# EAGLE design Illuminator v2 (EAGLE 9.6.2)
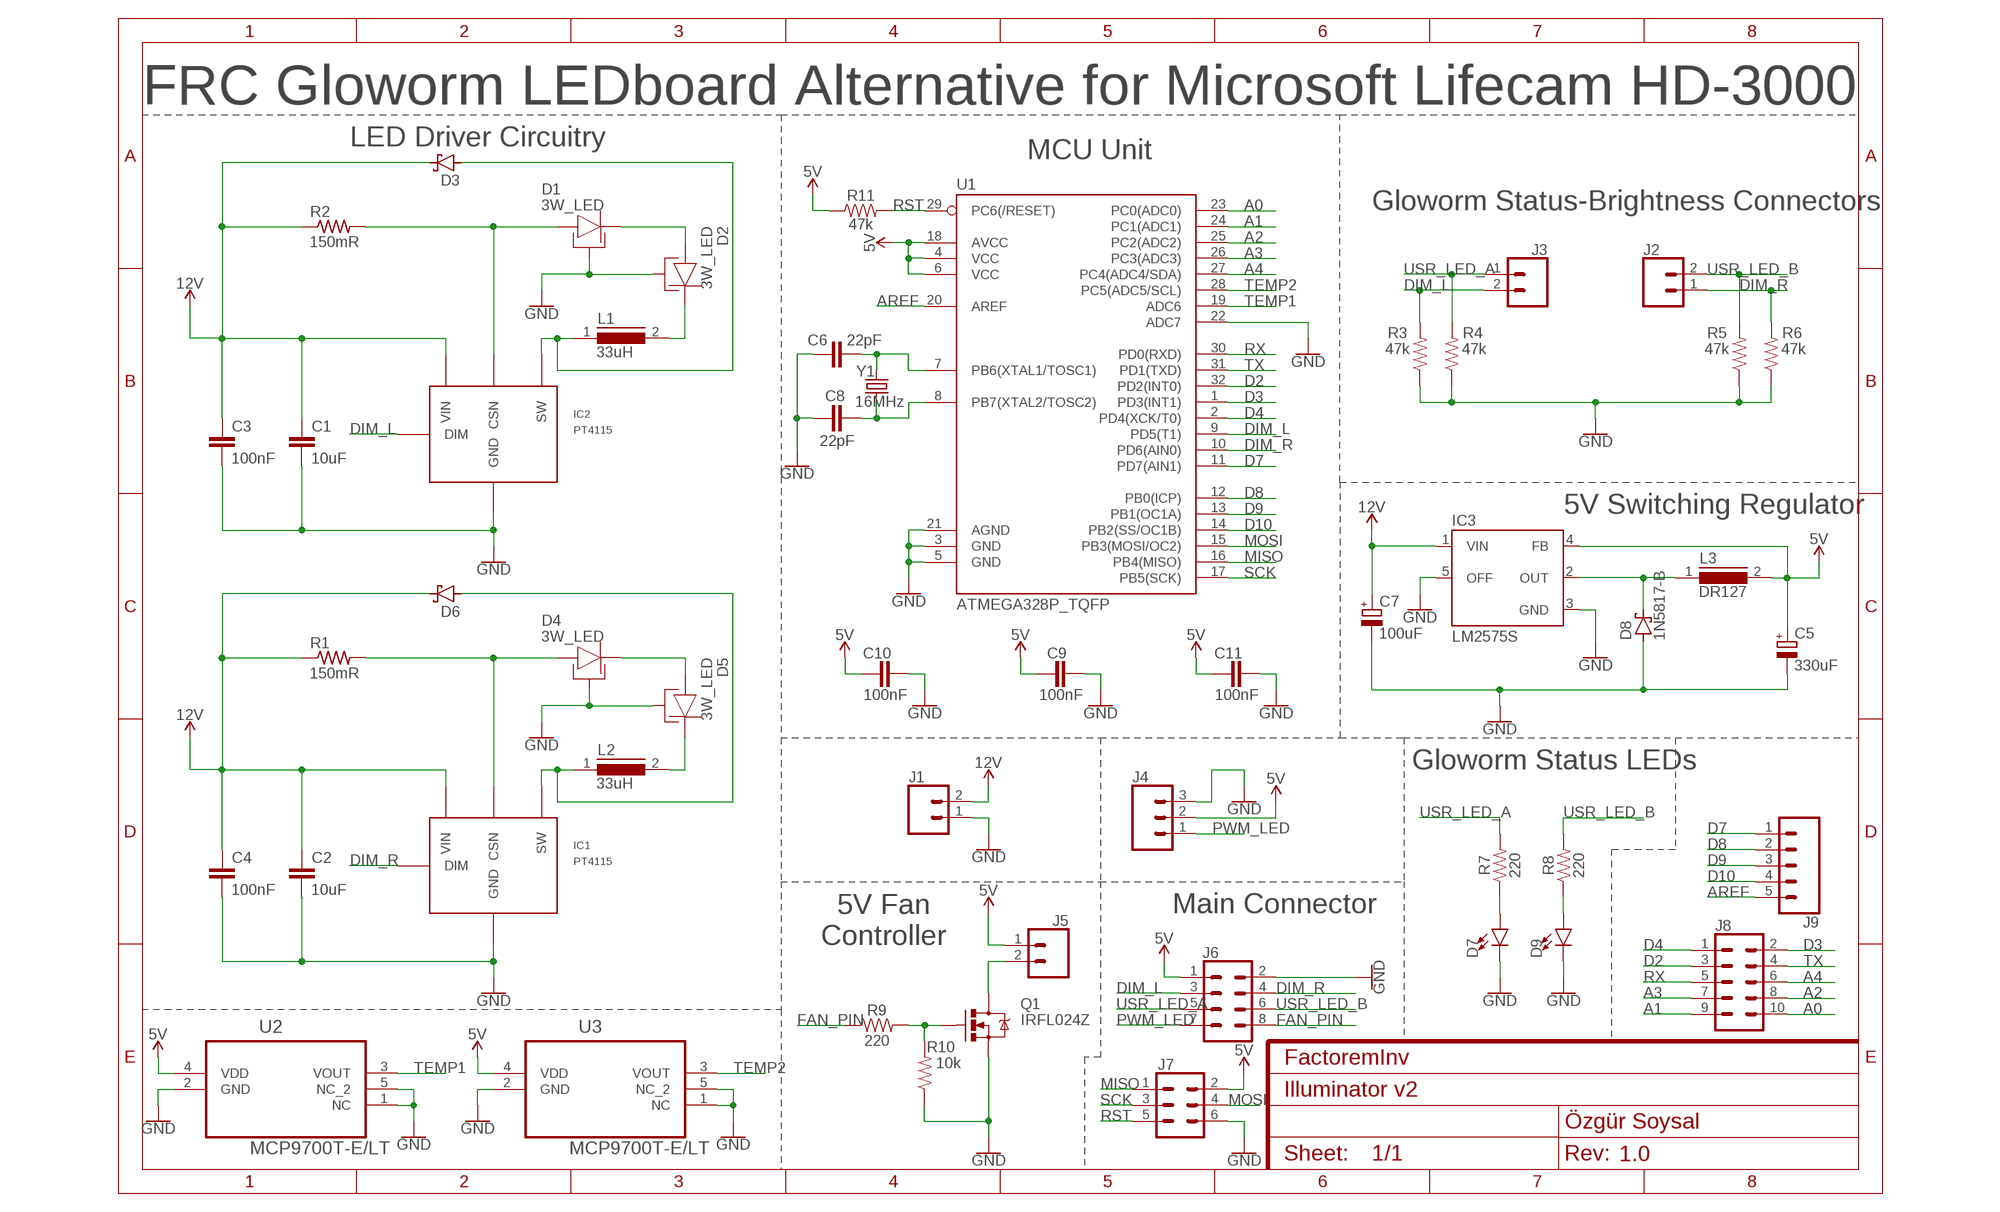
[diagram p0: schematic, sheet 1]
FRAME1 (FRAME-A4L): CNAME: FactoremInv; CREVISION: 1.0; DESIGNER: Özgür Soysal

## Parts
C1  10uF  10UF-1206-6.3V-20%  [1206]
C2  10uF  10UF-1206-6.3V-20%  [1206]
C3  100nF  1.0UF-0805-25V-(+80/-20%)  [0805]
C4  100nF  1.0UF-0805-25V-(+80/-20%)  [0805]
C5  330uF  C-POL_ECAP-10.5MM  [CAPAE1030X1050N]
C6  22pF  22PF-0603-50V-5%  [0603]
C7  100uF  C-POL_ECAP-8.5MM  [CAPAE830X1050N]
C8  22pF  22PF-0603-50V-5%  [0603]
C9  100nF  1.0UF-0805-25V-(+80/-20%)  [0805]
C10  100nF  1.0UF-0805-25V-(+80/-20%)  [0805]
C11  100nF  1.0UF-0805-25V-(+80/-20%)  [0805]
D1  3W_LED  [3W_LED]
D2  3W_LED  [3W_LED]
D3  SCHOTTKY-DIODESMD  [SMB]
D4  3W_LED  [3W_LED]
D5  3W_LED  [3W_LED]
D6  SCHOTTKY-DIODESMD  [SMB]
D7  LED1206  [LED-1206]
D8  1N5817-B  [DO41-7.6]
D9  LED1206  [LED-1206]
IC1  PT4115  [PT4115]
IC2  PT4115  [PT4115]
IC3  LM2575S  [TO263-5]
J1  CONN_02SPRING-2.54-RA  [SPRINGTERMINAL-2.54MM-2]
J2  CONN_02  [1X02]
J3  CONN_02  [1X02]
J4  CONN_03  [1X03]
J5  CONN_02  [1X02]
J6  CONN_04X2  [2X4]
J7  CONN_03X2NO_SILK  [2X3-NS]
J8  CONN_05X2NO_SILK  [2X5_NOSILK]
J9  CONN_05NO_SILK  [1X05_NO_SILK]
L1  33uH  DR125  [DR125]
L2  33uH  DR125  [DR125]
L3  DR127  [DR127]
Q1  IRFL024Z  MOSFET-NCHANNEL-SOT-223  [SOT-223]
R1  150mR  R-US_R2512  [R2512]
R2  150mR  R-US_R2512  [R2512]
R3  47k  RESISTOR0805  [0805]
R4  47k  RESISTOR0805  [0805]
R5  47k  RESISTOR0805  [0805]
R6  47k  RESISTOR0805  [0805]
R7  220  RESISTOR1206  [1206]
R8  220  RESISTOR1206  [1206]
R9  220  RESISTOR1206  [1206]
R10  10k  RESISTOR1206  [1206]
R11  47k  RESISTOR0805  [0805]
U1  ATMEGA328P_TQFP  [TQFP32-08]
U2  MCP9700T-E/LT  [SOT65P210X110-5N]
U3  MCP9700T-E/LT  [SOT65P210X110-5N]
Y1  16MHz  CRYSTAL-16MHZSMD-5X3.2  [CRYSTAL-SMD-5X3.2-4PAD]

## Nets
5V: C5.1(+) C9.1 C10.1 C11.1 IC3.4(FB) J4.2 J5.1 J6.1 J7.2 L3.2 R11.1 U1.4(VCC) U1.6(VCC) U1.18(AVCC) U2.4(VDD) U3.4(VDD)
12V: C1.1 C2.1 C3.1 C4.1 C7.1(+) D3.C D6.C IC1.5(VIN) IC2.5(VIN) IC3.1(VIN) J1.2 R1.1 R2.1
A0: J8.10 U1.23(PC0(ADC0))
A1: J8.9 U1.24(PC1(ADC1))
A2: J8.8 U1.25(PC2(ADC2))
A3: J8.7 U1.26(PC3(ADC3))
A4: J8.6 U1.27(PC4(ADC4/SDA))
AREF: J9.5 U1.20(AREF)
D2: J8.3 U1.32(PD2(INT0))
D3: J8.2 U1.1(PD3(INT1))
D4: J8.1 U1.2(PD4(XCK/T0))
D7: J9.1 U1.11(PD7(AIN1))
D8: J9.2 U1.12(PB0(ICP))
D9: J9.3 U1.13(PB1(OC1A))
D10: J9.4 U1.14(PB2(SS/OC1B))
DIM_L: IC2.3(DIM) J3.2 J6.3 R3.2 U1.9(PD5(T1))
DIM_R: IC1.3(DIM) J2.1 J6.4 R6.2 U1.10(PD6(AIN0))
FAN_PIN: J6.8 R9.1
GND: C1.2 C2.2 C3.2 C4.2 C5.2(-) C6.1 C7.2(-) C8.1 C9.2 C10.2 C11.2 D1.B_PAD D2.B_PAD D4.B_PAD D5.B_PAD D7.C D8.A D9.C IC1.2(GND) IC1.2A(GND) IC2.2(GND) IC2.2A(GND) IC3.3(GND) IC3.5(OFF) J1.1 J4.3 J6.2 J7.6 Q1.3(S) R3.1 R4.1 R5.1 R6.1 R10.1 U1.3(GND) U1.5(GND) U1.21(AGND) U1.22(ADC7) U2.1(NC) U2.2(GND) U2.5(NC_2) U3.1(NC) U3.2(GND) U3.5(NC_2)
MISO: J7.1 U1.16(PB4(MISO))
MOSI: J7.4 U1.15(PB3(MOSI/OC2))
N$1: D4.ANODE IC1.4(CSN) R1.2
N$2: D1.ANODE IC2.4(CSN) R2.2
N$3: D1.CATHODE D2.ANODE
N$4: D3.A IC2.1(SW) L1.1
N$5: D2.CATHODE L1.2
N$6: D4.CATHODE D5.ANODE
N$7: D6.A IC1.1(SW) L2.1
N$8: D5.CATHODE L2.2
N$9: C8.2 U1.8(PB7(XTAL2/TOSC2)) Y1.1
N$10: D8.C IC3.2(OUT) L3.1
N$12: D7.A R7.1
N$13: D9.A R8.1
N$14: Q1.1(G) R9.2 R10.2
N$16: J5.2 Q1.2(D) Q1.4(D)
N$19: C6.2 U1.7(PB6(XTAL1/TOSC1)) Y1.3
PWM_LED: J4.1 J6.7
RST: J7.5 R11.2 U1.29(PC6(/RESET))
RX: J8.5 U1.30(PD0(RXD))
SCK: J7.3 U1.17(PB5(SCK))
TEMP1: U1.19(ADC6) U2.3(VOUT)
TEMP2: U1.28(PC5(ADC5/SCL)) U3.3(VOUT)
TX: J8.4 U1.31(PD1(TXD))
USR_LED_A: J3.1 J6.5 R4.2 R7.2
USR_LED_B: J2.2 J6.6 R5.2 R8.2

## Notes on the sheet
- FRC Gloworm LEDboard Alternative for Microsoft Lifecam HD-3000
- LED Driver Circuitry
- MCU Unit
- Gloworm Status-Brightness Connectors
- 5V Switching Regulator
- Gloworm Status LEDs
- Main Connector
- 5V Fan 
  Controller

## Library data of the parts
C1 C2 = SparkFun-Capacitors:10UF: 10.0µF ceramic capacitors A capacitor is a passive two-terminal electrical component used to store electrical energy temporarily in an electric field.; PROD_ID: CAP-10057
C3 C4 C9-C11 = SparkFun-Capacitors:1.0UF: 1µF ceramic capacitors A capacitor is a passive two-terminal electrical component used to store electrical energy temporarily in an electric field.; PROD_ID: CAP-11625; VALUE: 1.0uF
C5 C7 = Capacitor:C-POL: Capacitor Polarised - Generic; CATEGORY: Capacitor
C6 C8 = SparkFun-Capacitors:22PF: 22pF ceramic capacitors A capacitor is a passive two-terminal electrical component used to store electrical energy temporarily in an electric field.; PROD_ID: CAP-07876
D1 D2 D4 D5 = FRC Components:3W_LED
D3 D6 = diode:SCHOTTKY-DIODE: Schottky Diode
D7 D9 = SparkFun-LED:LED: LED (Generic) Standard schematic elements and footprints for 5mm, 3mm, 1206, and 0603 sized LEDs. Generic LEDs with no color specified.
D8 = diode:1N581*: 1.0A SCHOTTKY BARRIER RECTIFIER Source: http://www.diodes.com/datasheets/ds23001.pdf
IC1 IC2 = PT4115:PT4115: 30V, 1.2A Step-down High Brightness LED Driver with 5000:1 Dimming PDF: http://www.google.pl/url?sa=t&rct=j&q=PT4115&source=web&cd=1&ved=0CC4QFjAA&url=http%3A%2F%2Fwww.micro-bridge.com%2Fdata%2FCRpowtech%2FPT4115E.pdf&ei=9NbxUKXPJNSzhAem2oGoAQ&usg=AFQjCNEsPWIIWjIVjxpF5YN6SPR3coTTpw&bvm=bv.1357700187,d.d2k
IC3 = v-reg-3:LM2575: National Semiconductor <http://www.national.com> 1.0A "Simple Switcher"(c) 52kHz, Vout 1.23-37V (HV: 57V), Vin 40V (HV: 60V), 50µA standby current
J1-J3 J5 = SparkFun-Connectors:CONN_02: Multi connection point. Often used as Generic Header-pin footprint for 0.1 inch spaced/style header connections On any of the 0.1 inch spaced packages, you can populate with these: Break Away Headers - Straight <https://www.sparkfun.com/products/116> (PRT-00116) Break Away Male Headers - Right Angle <https://www.sparkfun.com/products/553> (PRT-00553) Female Headers <https://www.sparkfun.com/products/115> (PRT-00115) Break Away Headers - Machine Pin <https://www.sparkfun.com/products/117> (PRT-00117) Break Away Female Headers - Swiss Machine Pin <https://www.sparkfun.com/products/743> (PRT-00743) For SCREWTERMINALS and SPRING TERMINALS visit here: Screw Terimnals on SparkFun.com <https://www.sparkfun.com/search/results?term=Screw+Terminals> (5mm/3.5mm/2.54mm spacing) This device is also useful as a general connection point to wire up your design to another part of your project. Our various solder wires solder well into these plated through hole pads. Hook-Up Wire - Assortment (Stranded, 22 AWG) <https://www.sparkfun.com/products/11375> (PRT-11375) Hook-Up Wire - Assortment (Solid Core, 22 AWG) <https://www.sparkfun.com/products/11367> (PRT-11367) View the entire wire category on our website here <https://www.sparkfun.com/categories/141> Special notes: Molex polarized connector foot print use with: PRT-08233 with associated crimp pins and housings. 2.54_SCREWTERM for use with PRT-10571. 3.5mm Screw Terminal footprints for PRT-08084 5mm Screw Terminal footprints for use with PRT-08432
J4 = SparkFun-Connectors:CONN_03: Multi connection point. Often used as Generic Header-pin footprint for 0.1 inch spaced/style header connections On any of the 0.1 inch spaced packages, you can populate with these: Break Away Headers - Straight <https://www.sparkfun.com/products/116> (PRT-00116) Break Away Male Headers - Right Angle <https://www.sparkfun.com/products/553> (PRT-00553) Female Headers <https://www.sparkfun.com/products/115> (PRT-00115) Break Away Headers - Machine Pin <https://www.sparkfun.com/products/117> (PRT-00117) Break Away Female Headers - Swiss Machine Pin <https://www.sparkfun.com/products/743> (PRT-00743) Stackable Header - 3 Pin (Female, 0.1") <https://www.sparkfun.com/products/13875> (PRT-13875) For SCREWTERMINALS and SPRING TERMINALS visit here: Screw Terimnals on SparkFun.com <https://www.sparkfun.com/search/results?term=Screw+Terminals> (5mm/3.5mm/2.54mm spacing) This device is also useful as a general connection point to wire up your design to another part of your project. Our various solder wires solder well into these plated through hole pads. Hook-Up Wire - Assortment (Stranded, 22 AWG) <https://www.sparkfun.com/products/11375> (PRT-11375) Hook-Up Wire - Assortment (Solid Core, 22 AWG) <https://www.sparkfun.com/products/11367> (PRT-11367) View the entire wire category on our website here <https://www.sparkfun.com/categories/141> Special notes: Molex polarized connector foot print use with SKU : PRT-08232 with associated crimp pins and housings.
J6 = SparkFun-Connectors:CONN_04X2: Multi connection point. Often used as Generic Header-pin footprint for 0.1 inch spaced/style header connections On any of the 0.1 inch spaced packages, you can populate with these: Break Away Headers - Straight <https://www.sparkfun.com/products/116> (PRT-00116) Break Away Male Headers - Right Angle <https://www.sparkfun.com/products/553> (PRT-00553) Female Headers <https://www.sparkfun.com/products/115> (PRT-00115) Break Away Headers - Machine Pin <https://www.sparkfun.com/products/117> (PRT-00117) Break Away Female Headers - Swiss Machine Pin <https://www.sparkfun.com/products/743> (PRT-00743)
J7 = SparkFun-Connectors:CONN_03X2: Multi connection point. Often used as Generic Header-pin footprint for 0.1 inch spaced/style header connections You can populate with any combo of single row headers, but if you'd like an exact match, check these: Header - 2x3 (Male, 0.1") <https://www.sparkfun.com/products/12807> (PRT-12807) Header - 2x3 (Female, 0.1") <https://www.sparkfun.com/products/13010> (PRT-13010) 2x3 Pin Shrouded Header <https://www.sparkfun.com/products/10877> (PRT-10877) On any of the 0.1 inch spaced packages, you can populate with these: Break Away Headers - Straight <https://www.sparkfun.com/products/116> (PRT-00116) Break Away Male Headers - Right Angle <https://www.sparkfun.com/products/553> (PRT-00553) Female Headers <https://www.sparkfun.com/products/115> (PRT-00115) Break Away Headers - Machine Pin <https://www.sparkfun.com/products/117> (PRT-00117) Break Away Female Headers - Swiss Machine Pin <https://www.sparkfun.com/products/743> (PRT-00743) Special note: the shrouded connector mates well with our 3x2 ribbon cables: Ribbon Crimp Connector - 6-pin (2x3, Female) <https://www.sparkfun.com/products/10651> (PRT-10651) Ribbon Cable - 6 wire (15ft) <https://www.sparkfun.com/products/10646> (PRT-10646)
J8 = SparkFun-Connectors:CONN_05X2: Multi connection point. Often used as Generic Header-pin footprint for 0.1 inch spaced/style header connections For AVR SPI programming port, see special device with nice symbol: "AVR_SPI_PROG_5x2.dev" You can populate with any combo of single row headers, but if you'd like an exact match, check these: 2x5 AVR ICSP Male Header <https://www.sparkfun.com/products/778> (PRT-00778) 2x5 Pin Shrouded Header <https://www.sparkfun.com/products/8506> (PRT-08506) On any of the 0.1 inch spaced packages, you can populate with these: Break Away Headers - Straight <https://www.sparkfun.com/products/116> (PRT-00116) Break Away Male Headers - Right Angle <https://www.sparkfun.com/products/553> (PRT-00553) Female Headers <https://www.sparkfun.com/products/115> (PRT-00115) Break Away Headers - Machine Pin <https://www.sparkfun.com/products/117> (PRT-00117) Break Away Female Headers - Swiss Machine Pin <https://www.sparkfun.com/products/743> (PRT-00743) Special note: the shrouded connector mates well with our 5x2 ribbon cables: 2x5 Pin IDC Ribbon Cable <https://www.sparkfun.com/products/8535> (PRT-08535)
J9 = SparkFun-Connectors:CONN_05: Multi connection point. Often used as Generic Header-pin footprint for 0.1 inch spaced/style header connections On any of the 0.1 inch spaced packages, you can populate with these: Break Away Headers - Straight <https://www.sparkfun.com/products/116> (PRT-00116) Break Away Male Headers - Right Angle <https://www.sparkfun.com/products/553> (PRT-00553) Female Headers <https://www.sparkfun.com/products/115> (PRT-00115) Break Away Headers - Machine Pin <https://www.sparkfun.com/products/117> (PRT-00117) Break Away Female Headers - Swiss Machine Pin <https://www.sparkfun.com/products/743> (PRT-00743) For SCREWTERMINALS and SPRING TERMINALS visit here: Screw Terimnals on SparkFun.com <https://www.sparkfun.com/search/results?term=Screw+Terminals> (5mm/3.5mm/2.54mm spacing) This device is also useful as a general connection point to wire up your design to another part of your project. Our various solder wires solder well into these plated through hole pads. Hook-Up Wire - Assortment (Stranded, 22 AWG) <https://www.sparkfun.com/products/11375> (PRT-11375) Hook-Up Wire - Assortment (Solid Core, 22 AWG) <https://www.sparkfun.com/products/11367> (PRT-11367) View the entire wire category on our website here <https://www.sparkfun.com/categories/141> Special notes: Molex polarized connector foot print use with SKU : PRT-08231 with associated crimp pins and housings. 1MM SMD Version SKU: PRT-10208
L1 L2 = inductors-2:DR125: High Power Density, High Efficiency, Shielded Inductors Source: coiltronics_dr_series.pdf
L3 = inductors-2:DR127: High Power Density, High Efficiency, Shielded Inductors Source: coiltronics_dr_series.pdf
Q1 = fets:MOSFET-NCHANNEL: Generic NMOS footprint
R1 R2 = adafruit:R-US_: RESISTOR, American symbol
R3-R11 = SparkFun-Resistors:RESISTOR: Generic Resistor Package
U1 = SparkFun-IC-Microcontroller:ATMEGA328P_TQFP: Popular 328P in QFP Storefront component: ATmega328 - TQFP <https://www.sparkfun.com/products/13448> (COM-13448) Datasheet <http://www.sparkfun.com/datasheets/Components/SMD/ATMega328.pdf> SparkFun Products SparkFun RedBoard - Programmed with Arduino <https://www.sparkfun.com/products/12757> (DEV-12757) Arduino Pro Mini 328 - 5V/16MHz <https://www.sparkfun.com/products/11113> (DEV-11113) Arduino Pro Mini 328 - 3.3V/8MHz <https://www.sparkfun.com/products/11114> (DEV-11114) SparkFun OpenLog <https://www.sparkfun.com/products/13712> (DEV-13712) SparkFun MicroView - OLED Arduino Module <https://www.sparkfun.com/products/12923> (DEV-12923) SparkFun Digital Sandbox <https://www.sparkfun.com/products/12651> (DEV-12651) SparkFun PicoBoard <https://www.sparkfun.com/products/11888> (WIG-11888) Arduino Fio <https://www.sparkfun.com/products/10116> (DEV-10116) LilyPad Arduino 328 Main Board <https://www.sparkfun.com/products/13342> (DEV-13342) SparkFun RedStick <https://www.sparkfun.com/products/13741> (DEV-13741) LilyPad MP3 <https://www.sparkfun.com/products/11013> (DEV-11013) LilyPad Arduino SimpleSnap <https://www.sparkfun.com/products/10941> (DEV-10941) SparkFun Stepoko <https://www.sparkfun.com/products/13899> (ROB-13899) SparkFun Geiger Counter <https://www.sparkfun.com/products/11345> (SEN-11345) SparkFun EL Sequencer <https://www.sparkfun.com/products/12781> (COM-12781) Arduino Pro 328 - 5V/16MHz <https://www.sparkfun.com/products/10915> (DEV-10915) CryptoCape <https://www.sparkfun.com/products/12773> (DEV-12773) SparkFun IR Thermometer Evaluation Board - MLX90614 <https://www.sparkfun.com/products/10740> (SEN-10740) SparkFun RedBot Mainboard <https://www.sparkfun.com/products/12097> (ROB-12097) Arduino Pro 328 - 3.3V/8MHz <https://www.sparkfun.com/products/10914> (DEV-10914) SparkFun Block for Intel® Edison - Arduino <https://www.sparkfun.com/products/13036> (DEV-13036) SparkFun Simon Says - Surface Mount Soldering Kit <https://www.sparkfun.com/products/10935> (KIT-10935) SparkFun 7-Segment Serial Display - Red <https://www.sparkfun.com/products/11441> (COM-11441) SparkFun 7-Segment Serial Display - White <https://www.sparkfun.com/products/11629> (COM-11629) SparkFun 7-Segment Serial Display - Yellow <https://www.sparkfun.com/products/11443> (COM-11443) SparkFun 7-Segment Serial Display - Kelly Green <https://www.sparkfun.com/products/11440> (COM-11440) SparkFun 7-Segment Serial Display - Blue <https://www.sparkfun.com/products/11442> (COM-11442) SparkFun OpenSegment Serial Display - 20mm (Blue) <https://www.sparkfun.com/products/11647> (COM-11647) SparkFun OpenSegment Serial Display - 20mm (Green) <https://www.sparkfun.com/products/11646> (COM-11646) SparkFun OpenSegment Serial Display - 20mm (White) <https://www.sparkfun.com/products/11648> (COM-11648) SparkFun OpenSegment Serial Display - 20mm (Red) <https://www.sparkfun.com/products/11644> (COM-11644) SparkFun OpenSegment Serial Display - 20mm (Yellow) <https://www.sparkfun.com/products/11645> (COM-11645) SparkFun OpenSegment Shield <https://www.sparkfun.com/products/13190> (DEV-13190); PROD_ID: IC-09069
U2 U3 = MCP9700T-E_LT:MCP9700T-E/LT: IC, TEMPERATURE SENSOR, ± 2°C Check prices <https://pricing.snapeda.com/parts/MCP9700T-E/LT/Microchip/view-part?ref=eda>; AVAILABILITY: Good; DESCRIPTION: Temperature Sensor Analog, Local -40°C ~ 125°C 10mV/°C SC-70-5; MF: Microchip; MP: MCP9700T-E/LT; PACKAGE: SC-70 Microchip; PRICE: None; PURCHASE-URL: https://pricing.snapeda.com/search/part/MCP9700T-E/LT/?ref=eda
Y1 = SparkFun-Clocks:CRYSTAL-16MHZ: 16MHz Crystal Digikey Example <http://www.digikey.com/product-search/en?keywords=535-9122-1-ND> Frequency: 16MHz Frequency Stability: ±50ppm Frequency Tolerance: ±20ppm Load Capacitance: 18pF SparkFun Products: Pro Micro -5V/16MHz <https://www.sparkfun.com/products/12640> SparkFun Serial Enabled LCD Kit <https://www.sparkfun.com/products/10097>; PROD_ID: XTAL-08218; SF_ID: COM-00094

## Board
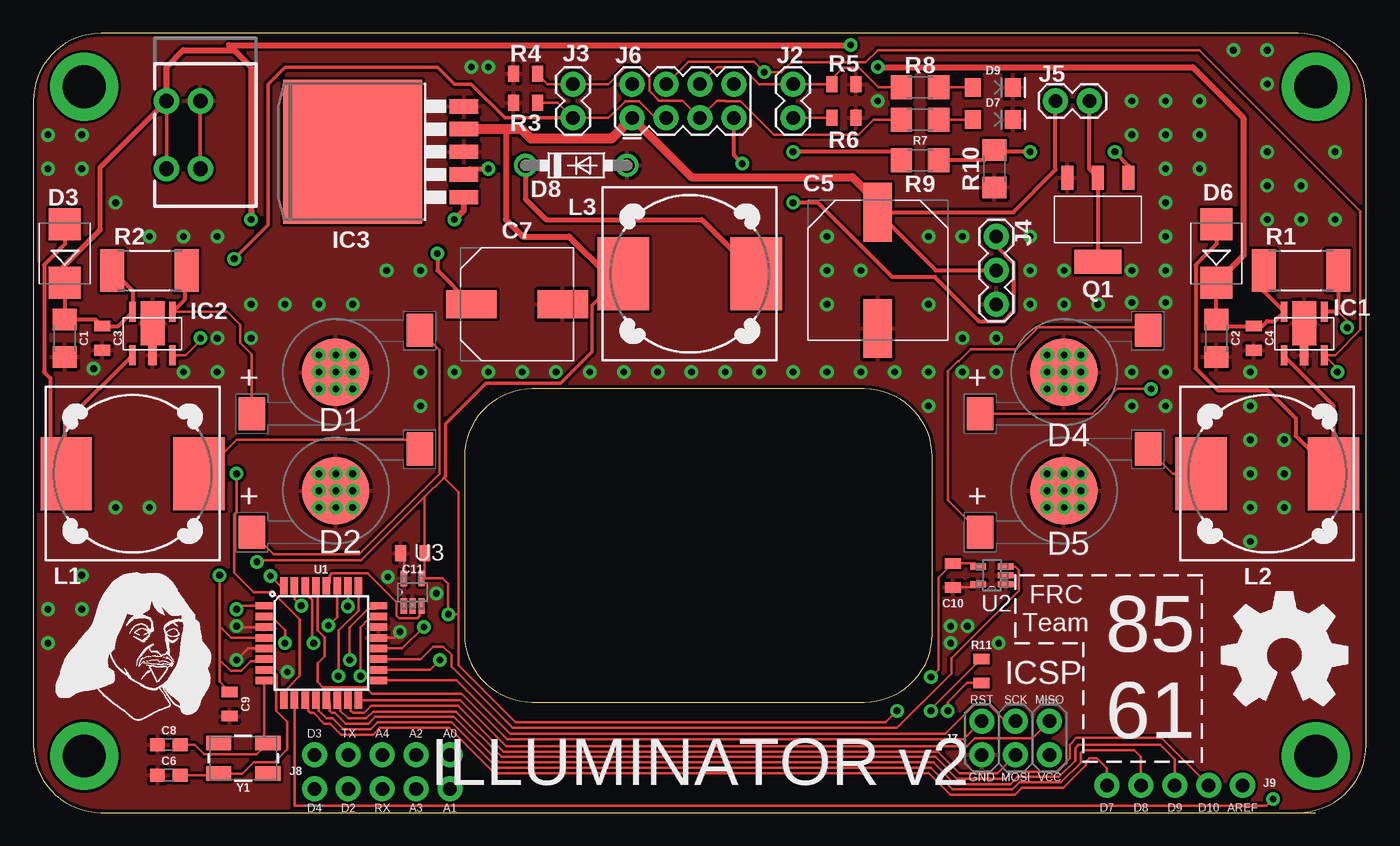
[diagram p1: board, top side]
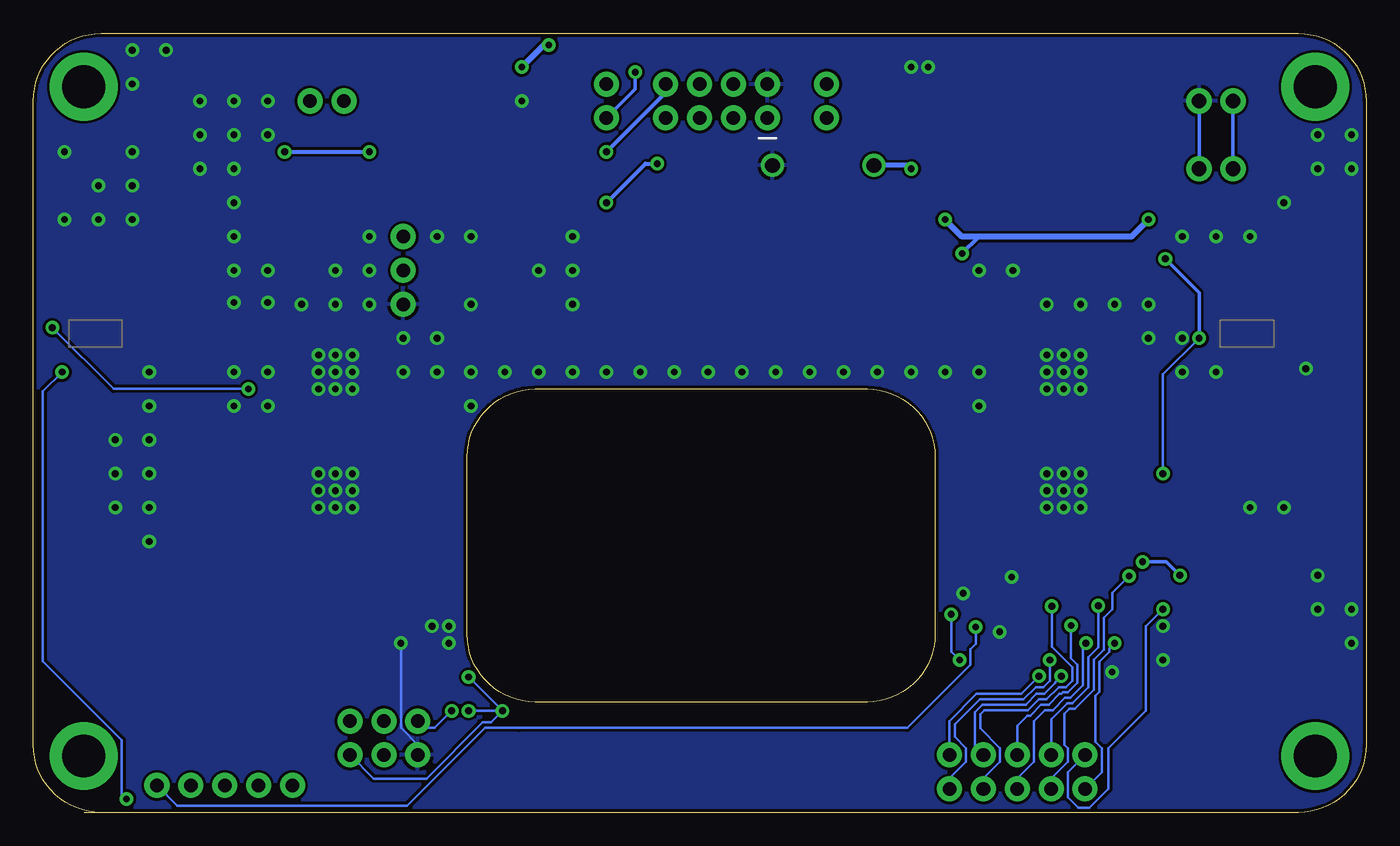
[diagram p2: board, bottom side, seen from below]

Size 99.95 x 58.41 mm. Coordinates in mm from the lower left corner, seen from the top.
Outline: 94.87,0 5.08,0 arc-90 0,5.08 0,53.33 arc-90 5.08,58.41 94.87,58.41 arc-90 99.95,53.33 99.95,5.08 arc-90 94.87,0
Outline: 94.87,0 96.14,0
Outline: 37.41,8.28 62.33,8.28 arc90 67.41,13.36 67.41,26.67 arc90 62.33,31.75 37.41,31.75 arc90 32.33,26.67 32.33,13.36 arc90 37.41,8.28
Copper layers (1*16): Top 0.035mm / dielectric 1.5mm / Bottom 0.035mm
Design rules "SparkFun": minimum track width 8mil, minimum drill 20mil, track to track 8mil, track to pad 8mil, pad to pad 8mil, via to via 8mil, smd to smd 8mil, copper to edge 10mil, drill to drill 8mil, minimum pad ring 12mil, minimum via ring 10mil, stop-mask expansion 4mil, vias tented up to drill 25mil, thermal gap 10mil

### Footprints (pad centres in the part's own frame; a part is rotated, then mirrored left to right if it is on the bottom)
1206 = smd 1.6 x 1.8: 1 -1.4,0; 2 1.4,0
0805 = smd 0.8 x 1.2: 1 -0.9,0; 2 0.9,0
CAPAE1030X1050N = smd 4.416 x 2.115: 1 -4.353,0; 2 4.353,0
0603 = smd 1.1 x 1: 1 -0.85,0; 2 0.85,0
CAPAE830X1050N = smd 3.764 x 2.115: 1 -3.426,0; 2 3.426,0
3W_LED = smd 2.032 x 2.54: ANODE -6.299,-3.124; CATHODE 6.299,3.124 | smd 5.08 x 5.08: B_PAD 0,0
SMB = smd 2.4 x 2.4: A 2.2,0; C -2.2,0
LED-1206 = smd 1.2 x 1.4: A -1.5,0; C 1.5,0
DO41-7.6 = drill 1.1 pad 1.7: A 3.81,0; C -3.81,0
PT4115 = smd 0.5 x 1.5: 1 0,0; 3 3,0; 4 3,3.25; 5 0,3.25 | smd 0.65 x 1.5: 2 1.5,0 | smd 1.8 x 3.3: 2A 1.5,2.375
TO263-5 = smd 1.067 x 2.159: 1 -3.404,-5.791; 2 -1.702,-5.791; 3 0,-5.791; 4 1.702,-5.791; 5 3.404,-5.791 | smd 10.8 x 10.41: 6 0,2.54
SPRINGTERMINAL-2.54MM-2 = drill 1.1 pad 1.9: 1 0,0; 2 2.54,0; P$2 0,5.08; P$3 2.54,5.08
1X02 = drill 1.016 pad 1.88: 1 0,0; 2 2.54,0
1X03 = drill 1.016 pad 1.88: 1 0,0; 2 2.54,0; 3 5.08,0
2X4 = drill 1.016 pad 1.88: 1 -3.81,-1.27; 2 -3.81,1.27; 3 -1.27,-1.27; 4 -1.27,1.27; 5 1.27,-1.27; 6 1.27,1.27; 7 3.81,-1.27; 8 3.81,1.27
2X3-NS = drill 1.016 pad 1.88: 1 -2.54,-1.27; 2 -2.54,1.27; 3 0,-1.27; 4 0,1.27; 5 2.54,-1.27; 6 2.54,1.27
2X5_NOSILK = drill 1.016 pad 1.88: 1 0,0; 2 0,2.54; 3 2.54,0; 4 2.54,2.54; 5 5.08,0; 6 5.08,2.54; 7 7.62,0; 8 7.62,2.54; 9 10.16,0; 10 10.16,2.54
1X05_NO_SILK = drill 1.016 pad 1.88: 1 0,0; 2 2.54,0; 3 5.08,0; 4 7.62,0; 5 10.16,0
DR125 = smd 3.85 x 5.5: 1 -4.975,0; 2 4.975,0
DR127 = smd 3.85 x 5.5: 1 -4.975,0; 2 4.975,0
SOT-223 = smd 0.9 x 1.8: 1 -2.3,-3.15; 2 0,-3.15; 3 2.3,-3.15 | smd 3.5 x 1.8: 4 0,3.15
R2512 = smd 1.8 x 3.2: 1 -2.8,0; 2 2.8,0
TQFP32-08 = smd 1.27 x 0.559: 1 -4.293,2.8; 2 -4.293,2; 3 -4.293,1.2; 4 -4.293,0.4; 5 -4.293,-0.4; 6 -4.293,-1.2; 7 -4.293,-2; 8 -4.293,-2.8; 17 4.293,-2.8; 18 4.293,-2; 19 4.293,-1.2; 20 4.293,-0.4; 21 4.293,0.4; 22 4.293,1.2; 23 4.293,2; 24 4.293,2.8 | smd 0.559 x 1.27: 9 -2.8,-4.293; 10 -2,-4.293; 11 -1.2,-4.293; 12 -0.4,-4.293; 13 0.4,-4.293; 14 1.2,-4.293; 15 2,-4.293; 16 2.8,-4.293; 25 2.8,4.293; 26 2,4.293; 27 1.2,4.293; 28 0.4,4.293; 29 -0.4,4.293; 30 -1.2,4.293; 31 -2,4.293; 32 -2.8,4.293
SOT65P210X110-5N = smd 1.168 x 0.457: 1 -1.041,0.66; 2 -1.041,0; 3 -1.041,-0.66; 4 1.041,-0.66; 5 1.041,0.66
CRYSTAL-SMD-5X3.2-4PAD = smd 1.9 x 1.1: 1 -1.85,-1.15; 2 1.85,-1.15; 3 1.85,1.15; 4 -1.85,1.15

### Placement (x,y rotation side)
C1  2.36,35.56 270 top
C2  88.72,35.56 270 top
C3  5.16,35.56 270 top
C4  91.52,35.56 270 top
C5  63.32,40.64 270 top
C6  10.16,2.79 0 top
C7  36.27,38.1 0 top
C8  10.16,5.08 0 top
C9  14.73,8.13 270 top
C10  68.96,17.78 270 top
C11  28.45,19.43 180 top
D1  22.68,33.02 0 top
D2  22.68,24.13 0 top
D3  2.36,41.91 90 top
D4  77.29,33.02 0 top
D5  77.29,24.13 0 top
D6  88.72,41.91 90 top
D7  71.96,51.94 0 top
D8  40.72,48.51 0 top
D9  71.96,54.36 0 top
IC1  93.8,34.29 0 top
IC2  7.44,34.29 0 top
IC3  26.49,49.53 90 top
J1  12.52,53.34 180 top
J2  56.97,52.07 90 top
J3  40.46,54.61 270 top
J4  72.21,43.18 270 top
J5  76.66,53.34 0 top
J6  48.72,53.34 0 top
J7  73.66,5.59 180 top
J8  21.08,1.78 0 top
J9  80.52,2.03 0 top
L1  7.44,25.4 0 top
L2  92.53,25.4 180 top
L3  49.23,40.39 180 top
Q1  79.83,44.45 180 top
R1  95.07,40.64 0 top
R2  8.71,40.64 0 top
R3  36.91,53.21 0 top
R4  36.91,55.37 0 top
R5  60.78,54.61 180 top
R6  60.78,52.07 180 top
R7  66.5,51.94 180 top
R8  66.5,54.36 180 top
R9  66.5,48.9 0 top
R10  72.09,48.26 90 top
R11  71.09,10.62 270 top
U1  21.59,12.7 0 top
U2  71.88,17.78 180 top
U3  28.45,16.51 90 top
Y1  15.75,4.06 180 top

### Tracks (layer width: path | path; a pad name or v marks a point on that pad's centre or on a via)
5V  (via drill 0.51)
  Top 0.203: 31.88,14.86 31.88,11.02 36.14,6.76 63.91,6.76 v64.77,7.62 | 31.88,14.86 31.88,24 30.79,25.09 29.35,23.66 | U1.18 29.75,10.7 v30.48,11.43 | 29.21,17.55 30.71,17.55 31.12,17.14 v31.12,14.86 31.88,14.86 | 29.21,17.55 U3.4 | U1.4 14.84,13.1 13.97,13.97 | 13.97,13.97 v13.97,17.78 | 13.97,11.43 13.97,9.79 C9.1 | 13.97,11.43 13.97,13.97 | U1.6 16.75,11.5 16.6,11.34 16.3,11.34 15.58,10.62 14.78,10.62 13.97,11.43 | U2.4 70.6,18.68 C10.1 67.87,17.59 67.87,10.72 v67.31,10.16 | 29.21,17.55 29.35,17.69 C11.1 29.35,23.66 | 29.35,23.66 24.59,18.9 16.87,18.9 v16.76,18.8 | R11.1 67.31,7.73 v67.31,7.62
  Top 0.254: L3.2 41.91,38.05 41.91,34.55 39.54,32.18 33.96,32.18 30.91,29.13 30.91,25.22 30.79,25.09
  Top 0.305: J4.2 67.68,40.64 C5.1 73.48,44.99 76.66,48.17 J5.1
  Top 0.457: L3.2 42.98,40.39 40.19,43.18 36.72,43.18 35.45,44.45 35.45,51.23
  Top 0.61: J6.1 49.35,47.62 61.42,47.62 63.32,45.72 C5.1
  Top 0.762: J6.1 43.38,50.55 37.29,50.55 36.61,51.23 35.45,51.23 IC3.4
  Bottom 0.203: v31.12,14.86 31.12,12.06 v30.48,11.43 | J7.2 74.42,2.54 70.48,2.54 66.26,6.76 65.63,6.76 v64.77,7.62 | v64.77,7.62 v67.31,10.16 | v67.31,7.62 v64.77,7.62
  Bottom 0.254: v13.97,17.78 14.99,18.8 v16.76,18.8
12V  (via drill 0.51)
  Top 0.305: R2.1 7.44,39.11 IC2.5 6.36,36.46 C3.1 4.66,36.96 C1.1 D3.C 2.36,40.64 2.17,40.83 | R1.1 92.27,39.07 IC1.5 93.09,36.83 92.53,36.83 92.16,36.46 C4.1 89.22,36.46 C2.1 D6.C | C7.1 30.3,40.64 v30.3,41.91
  Top 0.381: J1.2 5.03,48.39 5.03,43.69 2.17,40.83
  Top 0.457: J1.2 9.98,55.88 11.25,57.15 15.06,57.15 | v61.29,57.53 14.68,57.53 15.06,57.15 | v63.32,55.88 86.94,55.88 90.75,52.07 90.75,41.74 D6.C | 15.06,57.15 16.33,55.88 v16.33,44.45 | v31.57,44.45 32.28,45.16 IC3.1
  Bottom 0.305: v30.3,41.91 29.03,43.18
  Bottom 0.457: v63.32,55.88 61.67,57.53 v61.29,57.53 | v16.33,44.45 17.6,43.18 29.03,43.18 30.3,43.18 v31.57,44.45
A0  (via drill 0.51)
  Top 0.203: U1.23 25.67,14.48 25.12,14.48 24.54,13.9 v24.54,10.22
  Bottom 0.203: v24.54,10.22 25.87,8.89 29.21,8.89 31.24,6.86 J8.10
A1  (via drill 0.51)
  Top 0.203: U1.24 25.67,15.28 25.12,15.28 23.72,13.89 v23.72,11.43
  Bottom 0.203: v23.72,11.43 23.72,9.88 24.2,9.41 24.77,9.41 25.7,8.48 28.96,8.48 30.84,6.6 30.84,5.67 30,4.83 30,3.8 31.24,2.56 J8.9
A2  (via drill 0.51)
  Top 0.203: U1.25 24.39,15.13 22.91,13.65 22.91,10.27 v22.86,10.22
  Bottom 0.203: v22.86,10.22 23.32,9.76 23.32,9.72 24.14,8.89 24.72,8.89 25.53,8.08 28.79,8.08 29.35,7.51 29.35,4.97 J8.8
A3  (via drill 0.51)
  Top 0.203: U1.26 23.59,15.48 v23.58,15.46
  Bottom 0.203: v23.58,15.46 23.58,12.43 22.05,10.9 22.05,9.88 22.52,9.41 23.05,9.41 23.98,8.48 24.55,8.48 25.36,7.67 28.62,7.67 28.94,7.35 28.94,6.32 27.46,4.83 27.46,3.8 28.7,2.56 J8.7
A4  (via drill 0.51)
  Top 0.203: U1.27 22.79,15.83 22.76,15.8 22.76,14.65 v22.13,14.02
  Bottom 0.203: v22.13,14.02 22.13,11.56 21.64,11.07 21.64,9.72 22.36,9 22.75,9 22.86,8.89 22.99,8.89 23.81,8.08 24.38,8.08 25.19,7.26 25.4,7.26 26.16,6.5 J8.6
AREF  (via drill 0.51)
  Top 0.203: U1.20 27.67,12.3 v29.28,13.9
  Bottom 0.203: v29.28,13.9 29.28,12.63 29.67,12.24 29.67,11.09 34.41,6.35 63.5,6.35 66.09,6.35 71.93,0.51 89.15,0.51 J9.5
D2  (via drill 0.51)
  Top 0.203: U1.32 18.52,16.99 v17.78,17.73
  Bottom 0.203: v17.78,17.73 19.05,16.46 19.05,15.24 19.68,14.61 19.68,12.21 20.42,11.46 20.42,9.21 21.85,7.78 22.24,7.78 22.63,7.39 22.63,5.09 22.38,4.83 22.38,3.8 23.62,2.56 J8.3
D3  (via drill 0.51)
  Top 0.203: U1.1 15.5,15.5 v15.24,15.24
  Bottom 0.203: v15.24,15.24 16.51,13.97 16.51,7.62 19.33,4.8 19.33,1.77 20.74,0.36 21.59,0.36 22.38,1.14 22.38,3.02 J8.2
D4  (via drill 0.51)
  Top 0.203: U1.2 17.51,14.48 18.06,14.48 18.87,13.68 v18.87,12.7
  Bottom 0.203: v18.87,12.7 19.27,12.29 19.27,12.04 20.02,11.29 20.02,9.04 20.32,8.74 20.32,5.32 19.84,4.83 19.84,3.02 J8.1
D7
  Top 0.203: U1.11 20.61,8.19 20.61,7.65 20.78,7.47 21.01,7.47 21.82,6.65 22.27,6.65 23.09,5.84 25.47,5.84 25.98,6.35 31.19,6.35 34.6,2.95 67.15,2.95 68.77,1.32 73.59,1.32 74.12,1.85 77.24,1.85 78.94,3.56 78.94,3.81 79.2,4.06 79.76,4.06 80.52,3.3 J9.1
D8
  Top 0.203: U1.12 21.41,8.19 21.41,7.65 21.99,7.06 22.44,7.06 23.25,6.25 25.3,6.25 25.81,6.76 31.36,6.76 34.77,3.35 67.31,3.35 68.94,1.73 73.42,1.73 73.96,2.26 77.07,2.26 78.54,3.73 78.54,4.47 78.74,4.67 82.55,4.67 83.06,4.17 J9.2
D9
  Top 0.203: U1.13 22.21,8.19 22.21,7.65 22.38,7.47 22.61,7.47 23.42,6.65 25.13,6.65 25.64,7.16 31.53,7.16 34.93,3.76 67.48,3.76 69.11,2.13 73.25,2.13 73.79,2.67 76.9,2.67 78.13,3.9 78.13,4.83 78.38,5.08 84.52,5.08 85.6,4 J9.3
D10
  Top 0.203: U1.14 23.01,8.19 23.01,7.65 23.59,7.06 24.96,7.06 25.47,7.57 31.7,7.57 35.1,4.17 67.65,4.17 69.28,2.54 72.9,2.54 73.43,3.07 76.72,3.07 77.45,3.81 77.47,3.81 77.72,4.06 77.72,5.08 78.23,5.59 84.58,5.59 J9.4
DIM_L  (via drill 0.51)
  Top 0.203: J6.3 46.67,52.07 45.42,53.32 44.39,53.32 43.15,52.07 J3.2 39.32,53.21 R3.2 | IC2.3 11.43,34.29 12.52,35.38 v12.52,35.56 | U1.9 18.79,9.07 19.96,10.25 19.96,14.47 17.85,16.58 17.78,16.51 16.51,16.51 15.06,17.96 15.06,22.34 15.24,22.52 v15.24,25.4
  Top 0.254: v15.06,41.5 17.6,44.04 17.6,54.61 18.87,55.88 30.3,55.88 31.57,54.61 32.84,54.61 35.38,52.07 J3.2
  Bottom 0.203: v15.24,25.4 15.24,32.84 v12.52,35.56
  Bottom 0.254: v12.52,35.56 12.52,38.96 v15.06,41.5
DIM_R  (via drill 0.51)
  Top 0.203: J6.4 49.12,56.29 54.03,56.29 v54.81,55.5 56.1,55.5 56.84,56.24 62.41,56.24 63.32,57.15 87.45,57.15 99.52,45.09 99.52,36.19 97.62,34.29 IC1.3 97.79,33.3 v97.79,33.02 | J2.1 R6.2 | v92.96,1.02 92.46,0.51 19.59,0.51 U1.10
  Bottom 0.203: v92.96,1.02 93.32,1.37 93.32,5.42 99.24,11.34 99.24,31.57 v97.79,33.02
  Bottom 0.254: v54.81,55.5 54.81,54.23 J2.1
FAN_PIN  (via drill 0.51)
  Top 0.305: R9.1 64.46,49.53 v56.97,49.53
  Bottom 0.305: v56.97,49.53 52.53,53.98 J6.8
GND  (via drill 0.51)
  Top 0.203: U1.21 27.04,13.1 v27.48,13.54 | U1.3 15.31,13.9 v15.24,13.97 | U1.5 16.11,12.3 v15.24,11.43 | C11.2 27.79,19.19 U3.5 | C10.2 70.6,16.88 U2.5
  Bottom 0.203: J7.6 71.12,5.1 72.37,6.34 72.37,12.67 v72.39,12.7
  other vias: 32.84,55.88 34.11,55.88 4.52,33.27 63.32,53.34 91.26,33.02 92.53,49.53 22.68,34.29 23.95,34.29 23.95,33.02 22.68,33.02 21.41,33.02 21.41,31.75 22.68,31.75 23.95,31.75 21.41,25.4 22.68,25.4 23.95,25.4 23.95,24.13 22.68,24.13 21.41,24.13 21.41,22.86 22.68,22.86 23.95,22.86 77.29,25.4 76.02,25.4 78.56,25.4 78.56,24.13 76.02,24.13 77.29,24.13 77.29,22.86 76.02,22.86 78.56,22.86 76.02,34.29 77.29,34.29 78.56,34.29 78.56,33.02 77.29,33.02 76.02,33.02 76.02,31.75 77.29,31.75 78.56,31.75 92.53,46.99 92.53,44.45 95.07,44.45 97.61,44.45 95.07,46.99 82.37,53.34 82.37,50.8 84.91,50.8 84.91,53.34 87.45,53.34 87.45,50.8 87.45,48.26 84.91,48.26 84.91,45.72 84.91,43.18 84.91,40.64 82.37,40.64 77.29,40.64 77.29,38.1 79.83,38.1 82.37,38.23 84.91,38.23 74.75,38.1 74.75,40.64 74.75,43.18 72.21,35.56 72.21,33.02 69.67,35.56 69.67,33.02 67.13,30.48 67.13,33.02 64.59,33.02 84.91,33.02 82.37,33.02 84.91,30.48 82.37,30.48 91.26,30.48 91.26,27.94 91.26,25.4 91.26,22.86 91.26,20.32 93.8,22.86 93.8,25.4 93.8,27.94 21.41,34.29 16.33,35.56 13.79,33.02 11.25,33.02 18.87,38.1 16.33,38.1 13.79,35.56 21.41,38.1 23.95,38.1 29.03,33.02 31.57,33.02 34.11,33.02 36.65,33.02 39.19,33.02 41.73,33.02 44.27,33.02 46.81,33.02 49.35,33.02 51.89,33.02 54.43,33.02 56.97,33.02 59.51,33.02 62.05,33.02 59.51,38.1 59.51,40.64 59.51,43.18 62.05,40.64 67.13,38.1 67.13,43.18 69.67,43.18 29.03,30.48 8.71,22.86 6.17,22.86 26.49,40.64 29.03,40.64 13.79,43.18 11.25,43.18 8.71,43.18 6.17,45.72 3.63,50.8 1.09,50.8 1.09,48.26 3.63,48.26 3.63,15.24 1.09,15.24 1.09,12.7 3.63,17.78 97.61,49.53 89.99,57.15 92.53,54.61 92.53,57.15 19.05,10.54 30.23,16.43 26.59,17.65 68.78,13.97 70.05,13.97 68.78,12.7
  pour Bottom: -3.18,60.14 -3.18,-0.27 -2.72,-0.73 102.82,-0.73 102.82,60.14
  pour Top: -5.26,-2.54 105.23,-2.54 105.23,62.23 -5.26,62.23
MISO
  Top 0.203: U1.16 32.01,8.41 35.44,4.98 70.02,4.98 70.6,5.56 74.91,5.56 J7.1
MOSI
  Top 0.203: J7.4 72.29,2.95 69.44,2.95 67.82,4.57 35.27,4.57 31.84,8 25.33,8 24.8,7.47 23.98,7.47 23.81,7.65 23.81,8.19 U1.15
N$1  (via drill 0.51)
  Top 0.203: D4.ANODE 79.43,29.9 81.28,31.75 v83.82,31.75 | v98.53,36.35 98.53,36.86 97.84,37.54 IC1.4
  Top 0.305: IC1.4 97.61,37.54 97.87,37.8 R1.2
  Bottom 0.203: v83.82,31.75 93.93,31.75 v98.53,36.35
N$2
  Top 0.203: D1.ANODE 16.38,34.36 15.52,35.22 15.52,36.55 14.53,37.54 IC2.4
  Top 0.305: R2.2 11.38,40.51 11.38,38.48 IC2.4
N$3
  Top 0.203: D2.ANODE 18.03,19.36 24.44,19.36 30.48,25.4 30.48,34.65 D1.CATHODE
N$4
  Top 0.305: IC2.1 2.36,29.21 2.36,25.4 L1.1 1.27,26.6 1.27,32.56 0.81,33.02 0.81,41.06 2.36,42.61 D3.A
N$5
  Top 0.203: L1.2 12.56,25.26 15.24,27.94 28.3,27.94 D2.CATHODE
N$6
  Top 0.203: D5.ANODE 68.58,23.42 68.58,33.08 69.34,33.83 69.39,33.83 70.31,34.75 73.73,34.75 75.35,36.37 83.36,36.37 D4.CATHODE
N$7
  Top 0.305: IC1.1 93.8,34.21 97.51,30.51 L2.1 94.67,28.24 94.67,29.57 92.59,31.64 88.83,31.64 87.17,33.31 87.17,41.06 88.72,42.61 D6.A
N$8
  Top 0.203: L2.2 85.45,25.4 D5.CATHODE
N$9
  Top 0.203: C8.2 12.1,5.08 12.82,4.36 16.74,4.36 Y1.1 17.3,5.52 U1.8
N$10  (via drill 0.51)
  Top 0.381: IC3.2 32.72,48.26 v34.11,48.26 | D8.C 36.91,45.97 38.43,44.45 50.14,44.45 L3.1
  Bottom 0.381: v34.11,48.26 34.37,48.51 D8.C
N$11  (via drill 3.2 pad 5.08)
  other vias: 3.81,54.41
N$12
  Top 0.203: R7.1 D7.A
N$13
  Top 0.203: R8.1 D9.A
N$14  (via drill 0.51)
  Top 0.305: Q1.1 82.13,48.5 v81.1,49.53 | v74.75,49.53 72.22,49.53 R10.2 71.32,48.9 R9.2
  Bottom 0.305: v81.1,49.53 v74.75,49.53
N$15  (via drill 3.2 pad 5.08)
  other vias: 96.16,54.41
N$16
  Top 0.305: Q1.4 Q1.2 79.2,48.24 J5.2
N$17  (via drill 3.2 pad 5.08)
  other vias: 3.81,4.24
N$18  (via drill 3.2 pad 5.08)
  other vias: 96.16,4.24
N$19
  Top 0.203: C6.2 13.78,2.79 Y1.3 15.67,2.91 16.52,3.77 18.08,3.77 19.05,4.73 19.05,6.8 18.21,7.65 18.21,9.17 18.24,9.2 18.24,10.31 18.08,10.46 18.06,10.48 17.51,10.48 U1.7
PWM_LED  (via drill 0.51)
  Top 0.305: J4.1 72.21,42.47 73.51,41.18 73.51,37.56 72.75,36.8 70.94,36.8 67.62,40.13 64.42,40.13 58.83,45.72 v56.97,45.72 | v53.16,48.64 52.53,49.28 J6.7
  Bottom 0.305: v56.97,45.72 54.05,48.64 v53.16,48.64
RST  (via drill 0.51)
  Top 0.203: J7.5 69.75,5.48 35.54,5.48 32.12,8.9 25.41,8.9 24.9,9.41 21.71,9.41 21.32,9.8 21.32,11.18 21.84,11.7 21.84,13.15 21.32,13.68 21.32,16.87 U1.29 | R11.2 70.02,9.72 68.58,8.28 v68.58,7.62
  Bottom 0.203: v68.58,7.62 69.85,6.35 70.61,6.35 J7.5
RX  (via drill 0.51)
  Top 0.203: v21.01,12.7 20.9,12.81 20.9,15.94 20.61,16.23 20.61,16.78 U1.30
  Bottom 0.203: v21.01,12.7 21.23,12.48 21.23,9.55 22.19,8.6 22.58,8.6 23.5,7.67 24.08,7.67 24.92,6.83 24.92,3.8 26.16,2.56 J8.5
SCK
  Top 0.203: U1.17 31.73,9.9 35.73,5.89 68.39,5.89 70.6,8.1 71.64,8.1 72.88,6.86 J7.3
TEMP1
  Top 0.203: U2.3 73.64,18.44 73.91,18.16 73.91,16.64 68.83,11.56 68.83,10.41 64.77,6.35 35.94,6.35 31.36,10.93 31.36,11.82 30.73,12.45 29.97,12.45 29.03,11.5 U1.19
TEMP2
  Top 0.203: U3.3 28.98,15.34 28.98,14.76 28.8,14.58 27.43,14.58 27.25,14.76 27.25,15.75 25.07,17.93 22.38,17.93 22.21,17.75 22.21,17.21 U1.28
TX  (via drill 0.51)
  Top 0.203: U1.31 19.59,16 v20.09,15.5
  Bottom 0.203: J8.4 23.62,6.98 22.41,8.19 22.02,8.19 20.83,9.38 20.83,11.63 20.09,12.37 v20.09,15.5
USR_LED_A
  Top 0.203: R4.2 38.57,54.61 J3.1 43.15,54.61 44.39,55.86 45.42,55.86 46.2,55.08 46.2,54.09 46.93,53.37 48.69,53.37 J6.5 51.26,53.34 51.89,53.34 51.92,53.32 53.04,53.32 55.53,50.83 61.87,50.83 62.99,51.94 R7.2
USR_LED_B
  Top 0.203: J6.6 51.26,55.88 53.16,55.88 54.43,54.61 J2.2 59.51,54.61 | 59.51,54.61 R5.2 | R8.2 63.37,54.36 61.89,55.83 60.73,55.83 59.51,54.61

### Text on the board
tPlace: FRC / Team | ICSP | RST | SCK | MISO | D3 | TX | A4 | A2 | A0 | 85 / 61 | GND | MOSI | VCC | ILLUMINATOR v2 | D4 | D2 | RX | A3 | A1 | D7 | D8 | D9 | D10 | AREF